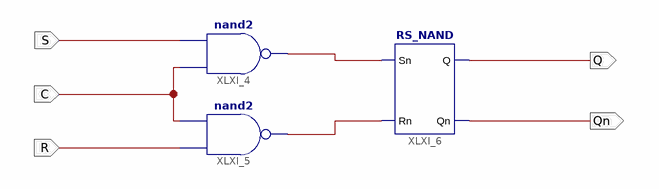
[diagram p0: schematic sheet 1]
// Xilinx ISE schematic RS_EN.sch (kintex7) as structural Verilog: 3 symbols, 5 ports
module RS_EN (
  input  C,
  input  S,
  input  R,
  output Q,
  output Qn
);

  wire XLXN_6, XLXN_7;

  nand XLXI_4 (XLXN_6, C, S);
  nand XLXI_5 (XLXN_7, R, C);
  RS_NAND XLXI_6 (.Sn(XLXN_6), .Rn(XLXN_7), .Q(Q), .Qn(Qn));
endmodule
